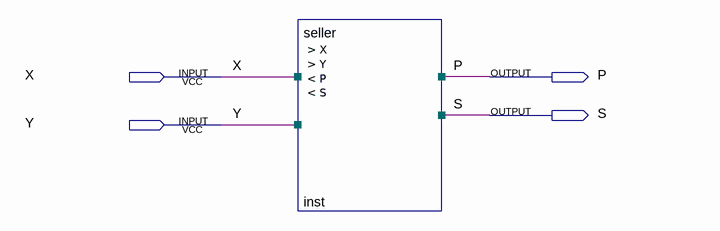
[diagram p0: schematic sheet]
// Quartus schematic autoseller_notimer.bdf as structural Verilog: 1 symbols, 4 pins
module autoseller_notimer (
  input  X,
  input  Y,
  output P,
  output S
);

  seller inst (.X(X), .Y(Y), .P(P), .S(S));
endmodule
